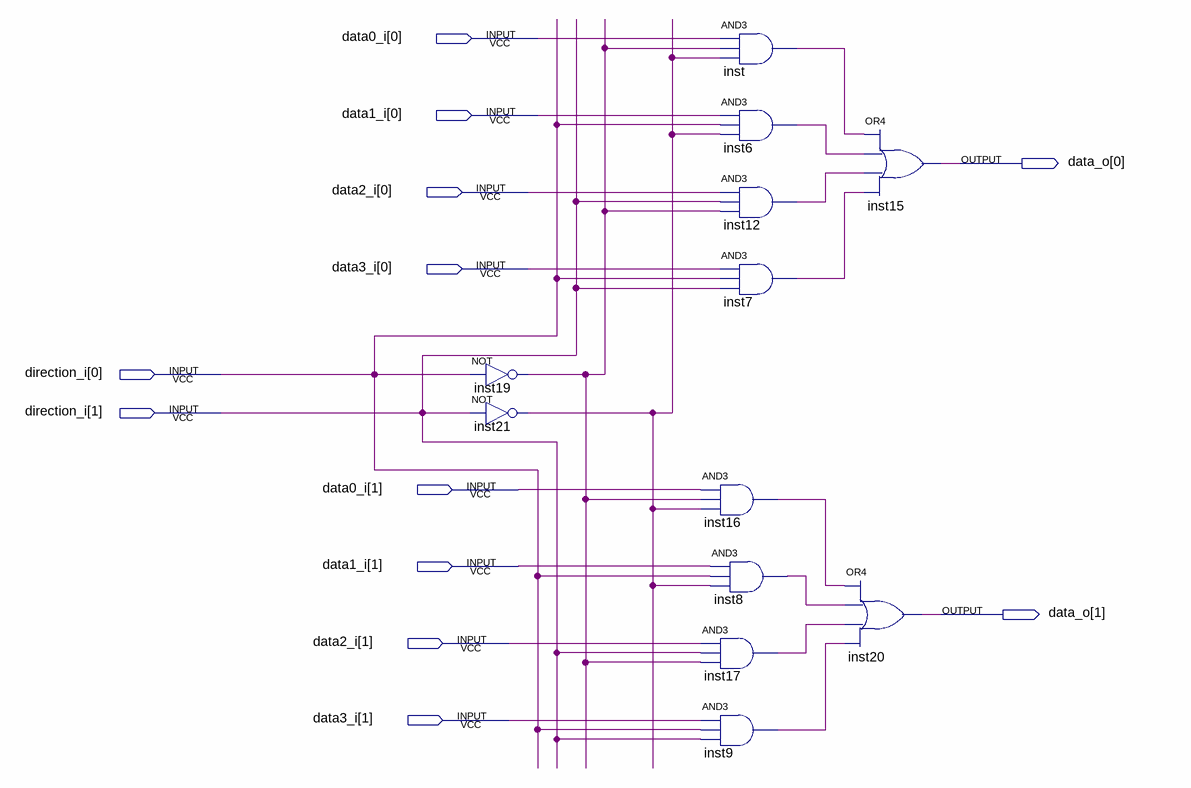
[diagram p0: schematic sheet]
// Quartus schematic mux.bdf as structural Verilog: 12 symbols, 12 pins
module mux (
  input  [1:0] data0_i,
  input  [1:0] data1_i,
  input  [1:0] data2_i,
  input  [1:0] data3_i,
  input  [1:0] direction_i,
  output [1:0] data_o
);

  wire inst6_out, inst7_out, inst8_out, inst9_out, inst12_out, inst16_out, inst17_out, inst19_out,
       inst21_out, inst_out;

  not inst19 (inst19_out, direction_i[0]);
  not inst21 (inst21_out, direction_i[1]);
  and inst (inst_out, data0_i[0], inst19_out, inst21_out);
  and inst6 (inst6_out, data1_i[0], direction_i[0], inst21_out);
  and inst12 (inst12_out, data2_i[0], direction_i[1], inst19_out);
  and inst7 (inst7_out, data3_i[0], direction_i[0], direction_i[1]);
  and inst16 (inst16_out, data0_i[1], inst19_out, inst21_out);
  and inst8 (inst8_out, data1_i[1], direction_i[0], inst21_out);
  and inst17 (inst17_out, data2_i[1], direction_i[1], inst19_out);
  and inst9 (inst9_out, data3_i[1], direction_i[0], direction_i[1]);
  or inst15 (data_o[0], inst_out, inst6_out, inst12_out, inst7_out);
  or inst20 (data_o[1], inst16_out, inst8_out, inst17_out, inst9_out);
endmodule
